# Altium project plantGrowthLeds_4chnl.PrjPCB
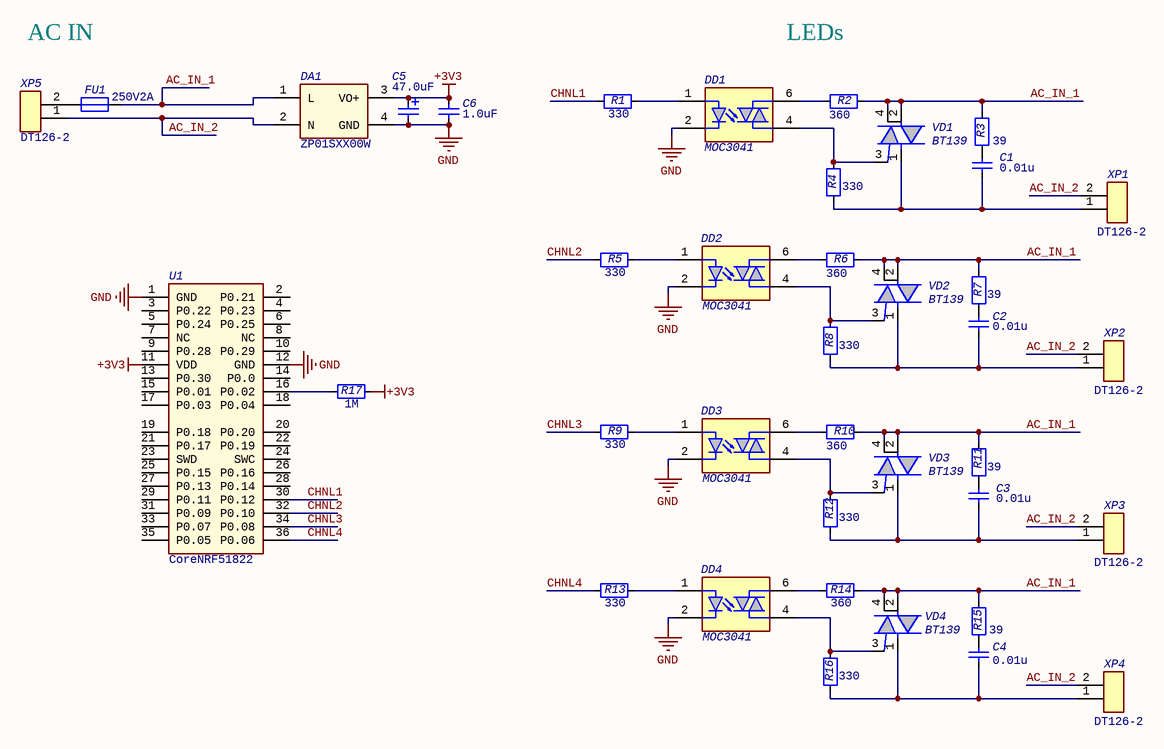
[diagram p0: plantGrowthLeds_4chnl.SchDoc]
1 sheet, 39 parts. Net scope: global (net labels, ports and power ports of the same name join across sheets).
Board file: plantGrowthLeds_4chnl.PcbDoc

## Sheet plantGrowthLeds_4chnl.SchDoc: Plant Leds 4chnl
size A4; Author: Nikolai Chizhov; Revision: 1.0; SheetNumber: 1; SheetTotal: 1

### Parts
C1  0.01u  [C1206]
C2  0.01u  [C1206]
C3  0.01u  [C1206]
C4  0.01u  [C1206]
C5  47.0uF  [C_B_COMPACT]
C6  1.0uF  [C0805_COMPACT]
DA1  ZP01SXX00W  [ZP01SXX0W]
DD1  MOC3041  [DIP6]
DD2  MOC3041  [DIP6]
DD3  MOC3041  [DIP6]
DD4  MOC3041  [DIP6]
FU1  value 250V2A  [FUSE_20x5mm_GLASS]  (hidden comment: FUSE_BOARD)
R1  330  [R0805_COMPACT]
R2  360  [R1206]
R3  39  [R1206]
R4  330  [R1206]
R5  330  [R0805_COMPACT]
R6  360  [R1206]
R7  39  [R1206]
R8  330  [R1206]
R9  330  [R0805_COMPACT]
R10  360  [R1206]
R11  39  [R1206]
R12  330  [R1206]
R13  330  [R0805_COMPACT]
R14  360  [R1206]
R15  39  [R1206]
R16  330  [R1206]
R17  1M  [R0805_COMPACT]
U1  CoreNRF51822  [BOARD_CORE_NRF51822]
VD1  BT139  [TO220-lie]
VD2  BT139  [TO220-lie]
VD3  BT139  [TO220-lie]
VD4  BT139  [TO220-lie]
XP1  DT126-2  [DT126-2-5mm]
XP2  DT126-2  [DT126-2-5mm]
XP3  DT126-2  [DT126-2-5mm]
XP4  DT126-2  [DT126-2-5mm]
XP5  DT126-2  [DT126-2-5mm]

### Nets
+3V3: C5.1(P) C6.2(M) DA1.3(VO+) R17.2 U1.11(VDD)
GND: C5.2(M) C6.1(P) DA1.4(GND) DD1.2(GND) DD2.2(GND) DD3.2(GND) DD4.2(GND) U1.1(GND) U1.12(GND)
AC_IN_1: DA1.1(L) FU1.1 R2.2 R3.2 R6.2 R7.2 R10.2 R11.2 R14.2 R15.2 VD1.2(T2) VD1.4(HEAT) VD2.2(T2) VD2.4(HEAT) VD3.2(T2) VD3.4(HEAT) VD4.2(T2) VD4.4(HEAT)
AC_IN_2: DA1.2(N) XP1.2 XP2.2 XP3.2 XP4.2 XP5.1
CHNL1: R1.1 U1.30(P0.12)
CHNL2: R5.1 U1.32(P0.10)
CHNL3: R9.1 U1.34(P0.08)
CHNL4: R13.1 U1.36(P0.06)
NetC1_1: C1.1(P) R4.1 VD1.1(T1) XP1.1
NetC1_2: C1.2(M) R3.1
NetC2_1: C2.1(P) R8.1 VD2.1(T1) XP2.1
NetC2_2: C2.2(M) R7.1
NetC3_1: C3.1(P) R12.1 VD3.1(T1) XP3.1
NetC3_2: C3.2(M) R11.1
NetC4_1: C4.1(P) R16.1 VD4.1(T1) XP4.1
NetC4_2: C4.2(M) R15.1
NetDD1_1: DD1.1(VCC) R1.2
NetDD1_4: DD1.4(MT) R4.2 VD1.3(G)
NetDD1_6: DD1.6(MT) R2.1
NetDD2_1: DD2.1(VCC) R5.2
NetDD2_4: DD2.4(MT) R8.2 VD2.3(G)
NetDD2_6: DD2.6(MT) R6.1
NetDD3_1: DD3.1(VCC) R9.2
NetDD3_4: DD3.4(MT) R12.2 VD3.3(G)
NetDD3_6: DD3.6(MT) R10.1
NetDD4_1: DD4.1(VCC) R13.2
NetDD4_4: DD4.4(MT) R16.2 VD4.3(G)
NetDD4_6: DD4.6(MT) R14.1
NetFU1_2: FU1.2 XP5.2
NetR17_1: R17.1 U1.16(P0.02)

Not connected (* = marked no-connect by the designer): U1 2(P0.21) 3(P0.22) 4(P0.23) 5(P0.24) 6(P0.25) 7(NC) 8(NC) 9(P0.28) 10(P0.29) 13(P0.30) 14(P0.0) 15(P0.01) 17(P0.03) 18(P0.04) 19(P0.18) 20(P0.20) 21(P0.17) 22(P0.19) 23(SWD) 24(SWC) 25(P0.15) 26(P0.16) 27(P0.13) 28(P0.14) 29(P0.11) 31(P0.09) 33(P0.07) 35(P0.05)

### Notes on the sheet
- AC IN
- LEDs
- Title:
- Author:
- Size:
- Date:
- A4
- Version:
- Time:
- Sheet
- of
- File:

### Library data of the parts
C1-C4 = C1206: Capacitor Chip 1206, Non-Polarized; package: 1206; value: 0.01u; Pin Count: 2
C5 = Cap_Ta_B-Size: Capacitor Polarized Tantalum, B-Size; package: B-Size; value: 47.0uF; Pin Count: 2
C6 = C0805: Capacitor Chip 0805, Non-Polarized; package: 0805; value: 1.0uF; Pin Count: 2
DA1 = ZP01SXX00W: AC-DC 1W Single Output Converter; Value: ZP01SXX00W
DD1-DD4 = MOC3041: Optoisolators Triac Driver Output 400V; Value: MOC3041; Pin Count: 6; Package: DIP-6
FU1 = FUSE_BOARD: Fuse Board
R1 R5 R9 R13 R17 = R0805: Resistor Chip 0805; package: 0805; Pin Count: 2
  R1 R5 R9 R13: value: 330
  R17: value: 1M
R2-R4 R6-R8 R10-R12 R14-R16 = R1206: Resistor Chip 1206; package: 1206; Pin Count: 2
  R2 R6 R10 R14: value: 360
  R3 R7 R11 R15: value: 39
  R4 R8 R12 R16: value: 330
U1 = CoreNRF51822: board Core NRF51822; Value: CoreNRF51822; Package: *; Pin Count: 36
VD1 = BT139_HEAT: Triac; Value: BT139; Package: TO-220AB; Pin Count: 4
VD2-VD4 = BT139: Triac; Value: BT139; Package: TO-220AB; Pin Count: 4
XP1-XP5 = DT126-2: Screw terminal 2 way 5mm; Value: DT126-2; Pin Count: 2